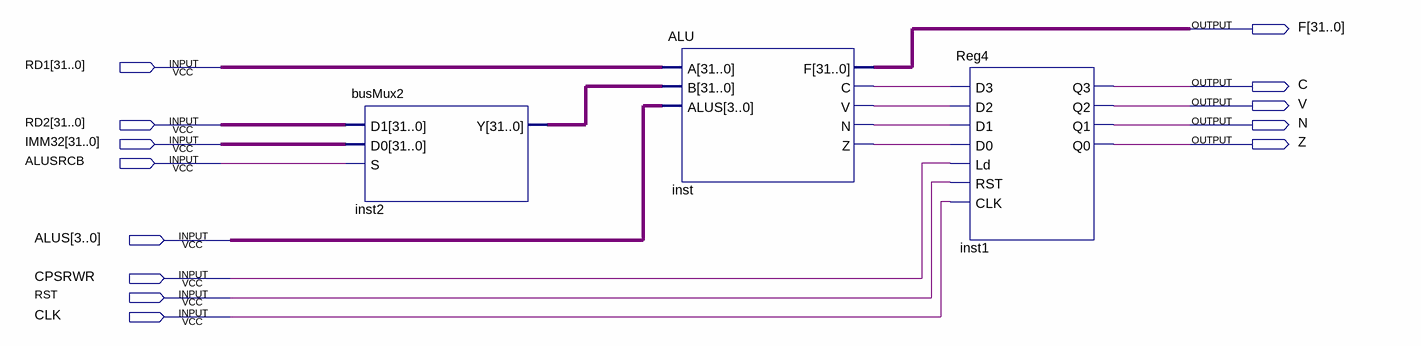
[diagram p0: schematic sheet]
// Quartus schematic Execute.bdf as structural Verilog: 3 symbols, 13 pins
module Execute (
  input  [31:0] RD1,
  input  [31:0] RD2,
  input  [31:0] IMM32,
  input  ALUSRCB,
  input  [3:0] ALUS,
  input  CPSRWR,
  input  RST,
  input  CLK,
  output [31:0] F,
  output C,
  output V,
  output N,
  output Z
);

  wire inst_c, inst_n, inst_v, inst_z;
  wire [31:0] inst2_y;

  busMux2 inst2 (.D1(RD2), .D0(IMM32), .S(ALUSRCB), .Y(inst2_y));
  ALU inst (.A(RD1), .B(inst2_y), .ALUS(ALUS), .F(F), .C(inst_c), .V(inst_v), .N(inst_n), .Z(inst_z));
  Reg4 inst1 (
    .D3(inst_c), .D2(inst_v), .D1(inst_n), .D0(inst_z), .Ld(CPSRWR), .RST(RST), .CLK(CLK), .Q3(C), .Q2(V),
    .Q1(N), .Q0(Z));
endmodule
